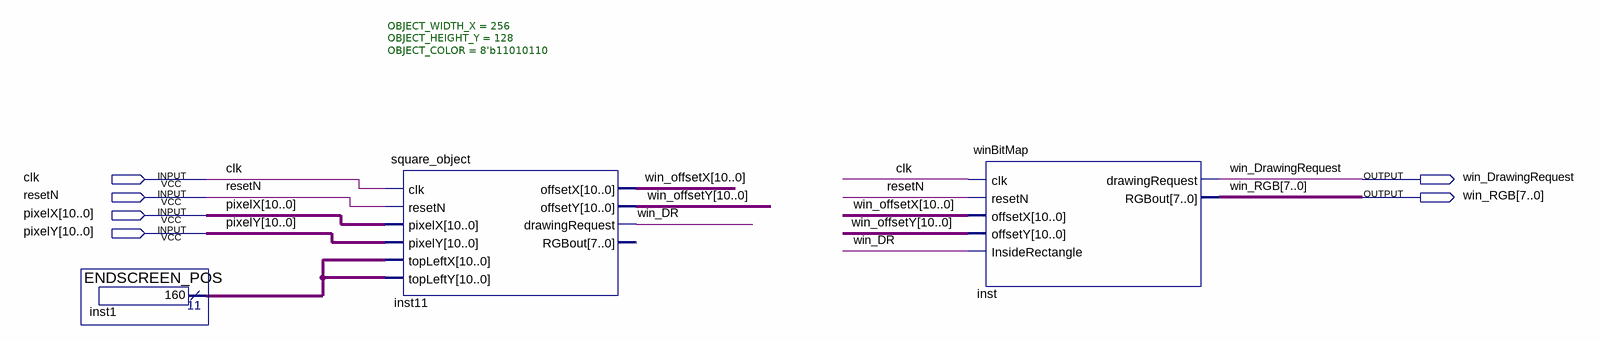
[diagram p0: schematic sheet]
// Quartus schematic WIN_DISPLAY.bdf as structural Verilog: 3 symbols, 6 pins
module WIN_DISPLAY (
  input  clk,
  input  resetN,
  input  [10:0] pixelX,
  input  [10:0] pixelY,
  output win_DrawingRequest,
  output [7:0] win_RGB
);

  wire win_DR;
  wire [10:0] inst1_result, win_offsetX, win_offsetY;

  ENDSCREEN_POS inst1 (.result(inst1_result));
  square_object #(.OBJECT_WIDTH_X(256), .OBJECT_HEIGHT_Y(128), .OBJECT_COLOR(8'b11010110)) inst11 (
    .clk(clk), .resetN(resetN), .pixelX(pixelX), .pixelY(pixelY), .topLeftX(inst1_result),
    .topLeftY(inst1_result), .offsetX(win_offsetX), .offsetY(win_offsetY), .drawingRequest(win_DR));  // open: RGBout
  winBitMap inst (
    .clk(clk), .resetN(resetN), .offsetX(win_offsetX), .offsetY(win_offsetY), .InsideRectangle(win_DR),
    .drawingRequest(win_DrawingRequest), .RGBout(win_RGB));
endmodule
